# Altium schematic sheet Buttons.SchDoc
size Letter; CompanyName: Ploopy Corporation; Organization: Ploopy Corporation; Address1: 137-1140 Burnhamthorpe Road W; Address2: Mississauga; Address3: Ontario; Address4: Canada L5C 0A3; DocumentNumber: 2; Revision: R2.002; SheetNumber: 2; SheetTotal: 9
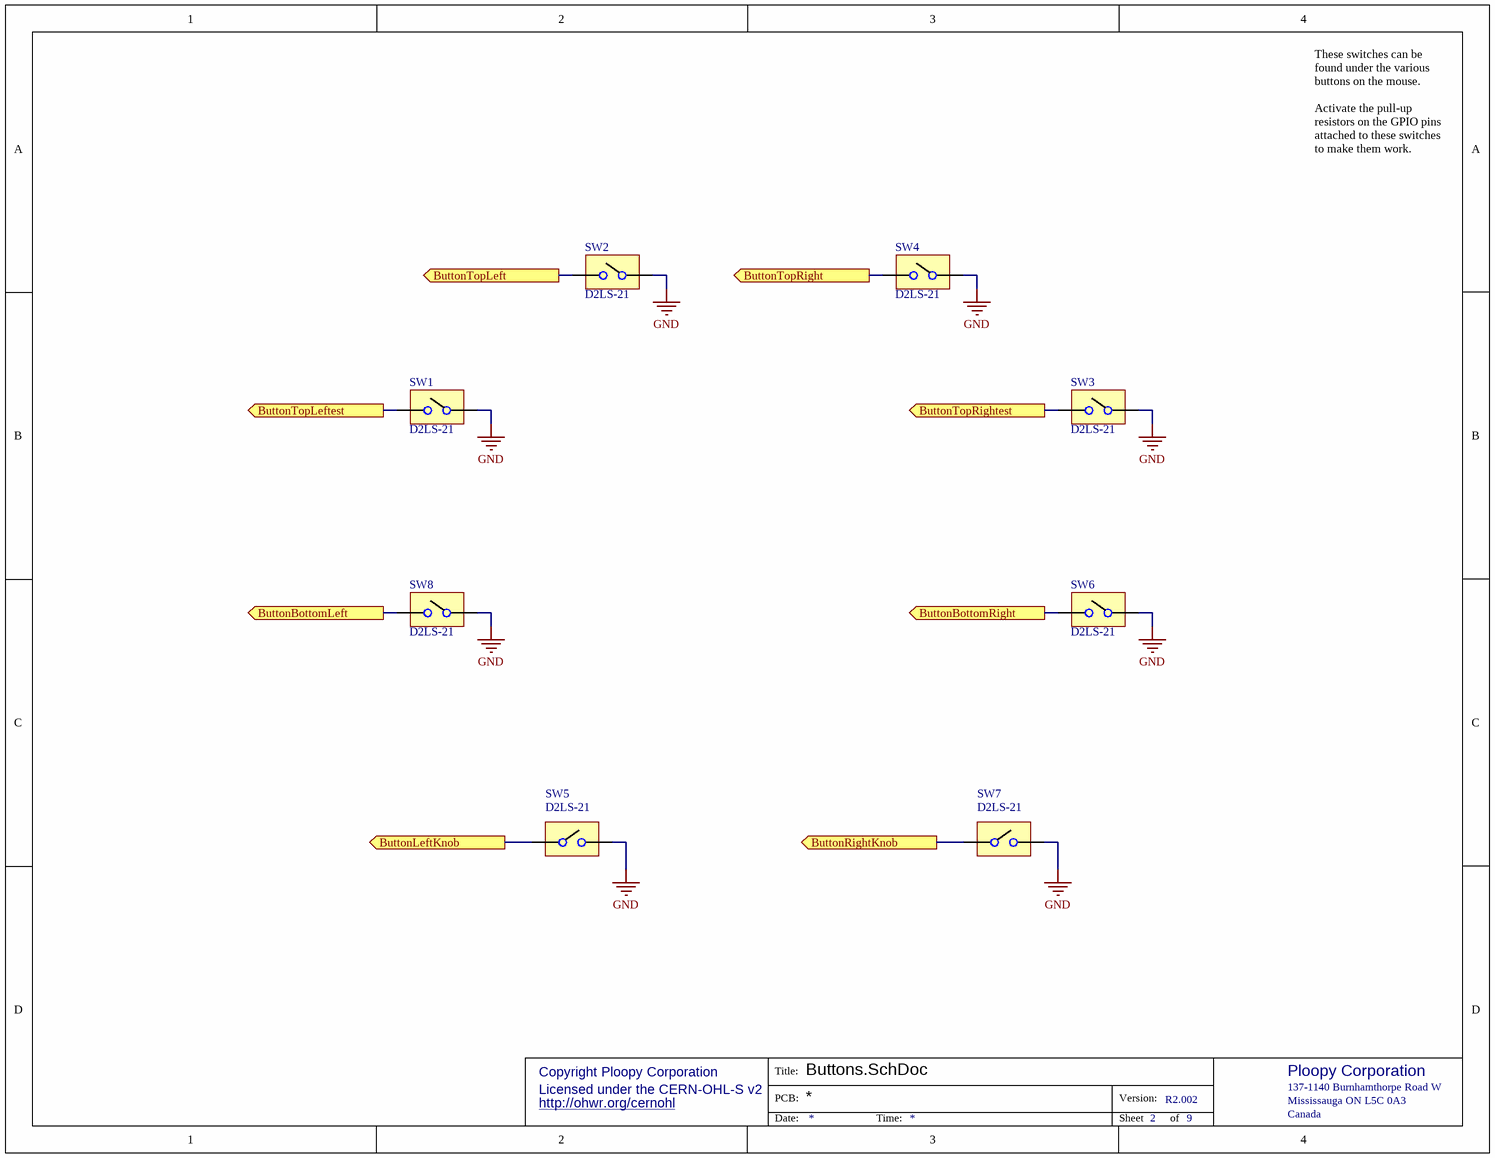
[diagram p0: Buttons.SchDoc]

## Parts
SW1  D2LS-21  [D2LS-21]
SW2  D2LS-21  [D2LS-21]
SW3  D2LS-21  [D2LS-21]
SW4  D2LS-21  [D2LS-21]
SW5  D2LS-21  [D2LS-21]
SW6  D2LS-21  [D2LS-21]
SW7  D2LS-21  [D2LS-21]
SW8  D2LS-21  [D2LS-21]

## Ports
ButtonBottomLeft (out), ButtonBottomRight (out), ButtonLeftKnob (out), ButtonRightKnob (out), ButtonTopLeft (out), ButtonTopLeftest (out), ButtonTopRight (out), ButtonTopRightest (out)

## Nets
GND: SW1.A SW2.A SW3.A SW4.A SW5.B SW6.A SW7.B SW8.A
ButtonBottomLeft: SW8.B ; port ButtonBottomLeft
ButtonBottomRight: SW6.B ; port ButtonBottomRight
ButtonLeftKnob: SW5.A ; port ButtonLeftKnob
ButtonRightKnob: SW7.A ; port ButtonRightKnob
ButtonTopLeft: SW2.B ; port ButtonTopLeft
ButtonTopLeftest: SW1.B ; port ButtonTopLeftest
ButtonTopRight: SW4.B ; port ButtonTopRight
ButtonTopRightest: SW3.B ; port ButtonTopRightest

## Notes on the sheet
- These switches can be found under the various buttons on the mouse.
  Activate the pull-up resistors on the GPIO pins attached to these switches to make them work.
- Copyright Ploopy Corporation
- Licensed under the CERN-OHL-S v2
- http://ohwr.org/cernohl
- Title:
- PCB:
- Version:
- Ploopy Corporation
- Mississauga ON L5C 0A3
- 137-1140 Burnhamthorpe Road W
- Date:
- Time:
- Sheet
- of
- Canada

## Library data of the parts
SW1-SW8 = D2LS-21: Compact Surface-mounting Switch for long durability; Supplier 1: Digi-Key; Supplier 2: Mouser; Supplier Part Number 1: Z4378CT-ND; Supplier Part Number 2: 653-D2LS-21